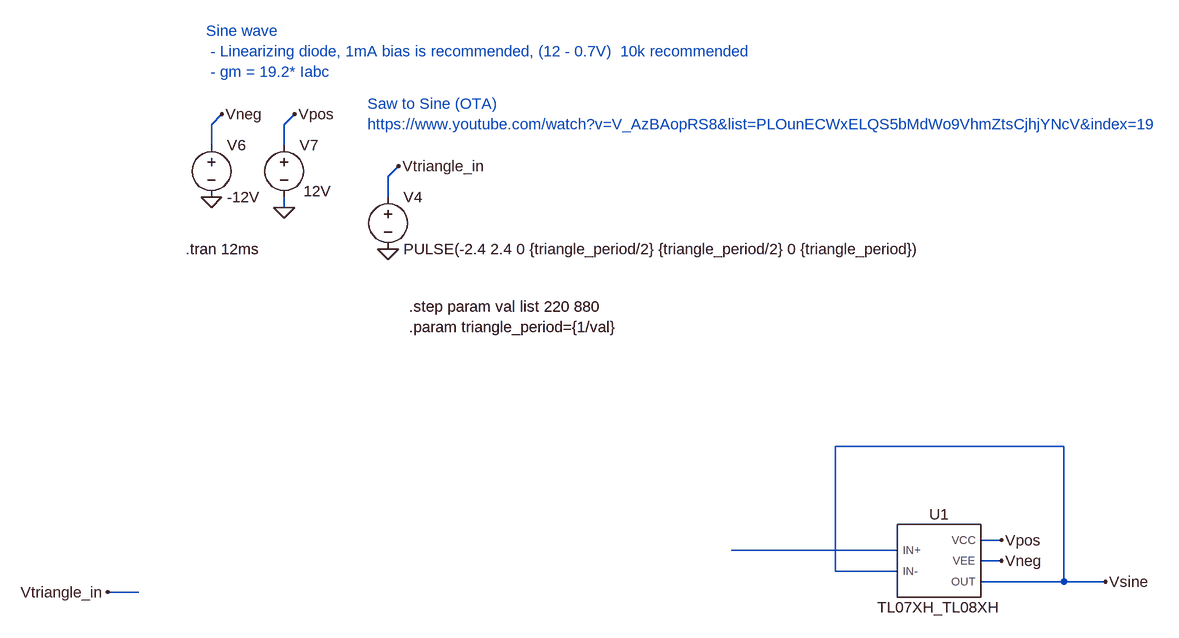
[diagram p0: schematic main_SAW_to_SQUARE.asc]
main_SAW_to_SQUARE.asc, the LTspice schematic file:
Version 4
SHEET 1 3072 1764
WIRE -368 -1216 -352 -1232
WIRE -256 -1216 -240 -1232
WIRE -368 -1184 -368 -1216
WIRE -256 -1184 -256 -1216
WIRE -96 -1136 -80 -1152
WIRE -96 -1104 -96 -1136
WIRE -256 -1088 -256 -1104
WIRE 944 -720 592 -720
WIRE 848 -576 816 -576
WIRE 688 -560 432 -560
WIRE 848 -544 816 -544
WIRE 592 -528 592 -720
WIRE 688 -528 592 -528
WIRE 944 -512 944 -720
WIRE 944 -512 816 -512
WIRE 1008 -512 944 -512
WIRE -480 -496 -528 -496
FLAG -368 -1104 0
FLAG -256 -1088 0
FLAG -352 -1232 Vneg
FLAG -240 -1232 Vpos
FLAG -96 -1024 0
FLAG -80 -1152 Vtriangle_in
FLAG -528 -496 Vtriangle_in
FLAG 848 -576 Vpos
FLAG 848 -544 Vneg
FLAG 1008 -512 Vsine
SYMBOL voltage -368 -1200 R0
WINDOW 123 0 0 Left 0
WINDOW 39 0 0 Left 0
SYMATTR InstName V6
SYMATTR Value -12V
SYMBOL voltage -256 -1200 R0
WINDOW 123 0 0 Left 0
WINDOW 39 0 0 Left 0
WINDOW 3 30 87 Left 2
SYMATTR Value 12V
SYMATTR InstName V7
SYMBOL voltage -96 -1120 R0
WINDOW 123 0 0 Left 0
WINDOW 39 0 0 Left 0
SYMATTR InstName V4
SYMATTR Value PULSE(-2.4 2.4 0 {triangle_period/2} {triangle_period/2} 0 {triangle_period})
SYMBOL TL07XH_TL08XH 752 -544 R0
SYMATTR InstName U1
TEXT -408 -1024 Left 2 !.tran 12ms
TEXT -128 -1248 Left 2 ;Saw to Sine (OTA)\nhttps://www.youtube.com/watch?v=V_AzBAopRS8&list=PLOunECWxELQS5bMdWo9VhmZtsCjhjYNcV&index=19
TEXT -64 -904 Left 2 !.param triangle_period={1/val}
TEXT -376 -1360 Left 2 ;Sine wave\n - Linearizing diode, 1mA bias is recommended, (12 - 0.7V)  10k recommended\n - gm = 19.2* Iabc
TEXT -64 -936 Left 2 !.step param val list 220 880

The netlist it stands for:
* main_SAW_to_SQUARE.asc
V6 Vneg 0 -12V
V7 Vpos 0 12V
V4 Vtriangle_in 0 PULSE(-2.4 2.4 0 {triangle_period/2} {triangle_period/2} 0 {triangle_period})
XU1 N001 Vsine Vpos Vneg Vsine TL07XH_TL08XH  ; pins IN+ IN- VCC VEE OUT
.tran 12ms
* Saw to Sine (OTA)
* https://www.youtube.com/watch?v=V_AzBAopRS8&list=PLOunECWxELQS5bMdWo9VhmZtsCjhjYNcV&index=19
.param triangle_period={1/val}
* Sine wave
*  - Linearizing diode, 1mA bias is recommended, (12 - 0.7V)  10k recommended
*  - gm = 19.2* Iabc
.step param val list 220 880
.lib C:\HOME_projects\SYNTH_GOOM\2LineartoExponential\tl07xh_tl08xh.lib
.backanno
.end